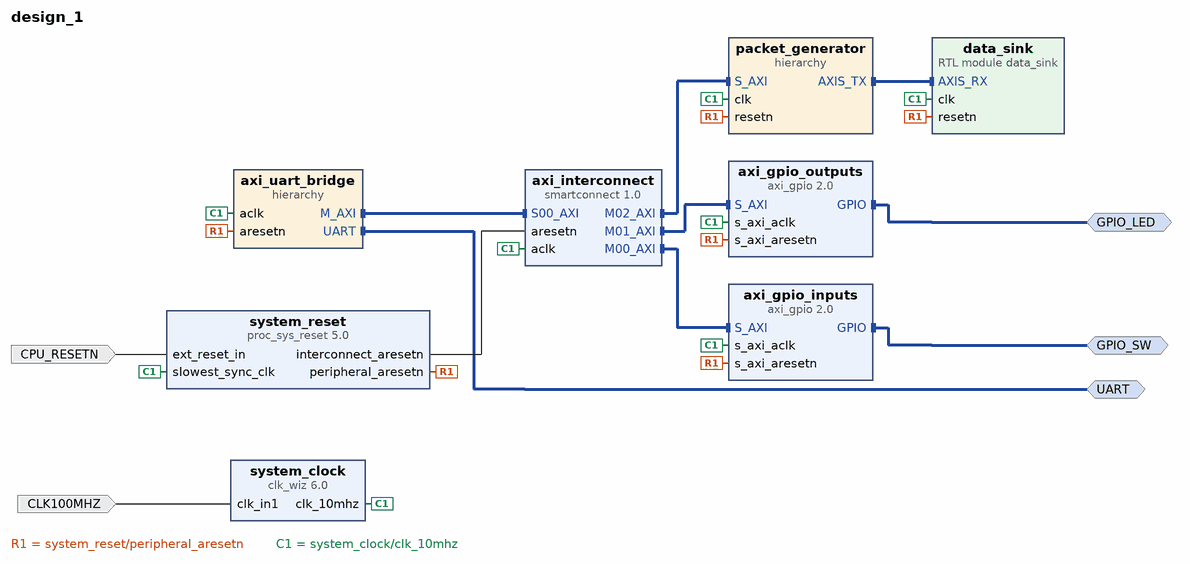
[diagram p0: block diagram of the top level]
# Vivado block design design_1, xc7a100tcsg324-1, Vivado 2021.1
create_bd_design design_1

create_bd_intf_port -mode Master -vlnv xilinx.com:interface:gpio_rtl:1.0 GPIO_LED
create_bd_intf_port -mode Master -vlnv xilinx.com:interface:gpio_rtl:1.0 GPIO_SW
create_bd_intf_port -mode Master -vlnv xilinx.com:interface:uart_rtl:1.0 UART
create_bd_port -dir I -type clk CLK100MHZ
set_property -dict {CONFIG.ASSOCIATED_RESET CPU_RESETN} [get_bd_ports CLK100MHZ]
create_bd_port -dir I -type rst CPU_RESETN

create_bd_cell -type ip -vlnv xilinx.com:ip:clk_wiz:6.0 system_clock
set_property -dict [list \
  CONFIG.CLKOUT1_DRIVES BUFGCE \
  CONFIG.CLKOUT1_JITTER 151.636 \
  CONFIG.CLKOUT1_PHASE_ERROR 98.575 \
  CONFIG.CLKOUT1_REQUESTED_OUT_FREQ 50.00 \
  CONFIG.CLKOUT2_DRIVES BUFGCE \
  CONFIG.CLKOUT3_DRIVES BUFGCE \
  CONFIG.CLKOUT4_DRIVES BUFGCE \
  CONFIG.CLKOUT5_DRIVES BUFGCE \
  CONFIG.CLKOUT6_DRIVES BUFGCE \
  CONFIG.CLKOUT7_DRIVES BUFGCE \
  CONFIG.CLK_OUT1_PORT clk_10mhz \
  CONFIG.FEEDBACK_SOURCE FDBK_AUTO \
  CONFIG.MMCM_CLKFBOUT_MULT_F 10.000 \
  CONFIG.MMCM_CLKOUT0_DIVIDE_F 20.000 \
  CONFIG.MMCM_DIVCLK_DIVIDE 1 \
  CONFIG.USE_LOCKED false \
  CONFIG.USE_RESET false \
  CONFIG.USE_SAFE_CLOCK_STARTUP true \
] [get_bd_cells system_clock]
create_bd_cell -type ip -vlnv xilinx.com:ip:proc_sys_reset:5.0 system_reset
set_property -dict {CONFIG.RESET_BOARD_INTERFACE reset CONFIG.USE_BOARD_FLOW true} [get_bd_cells system_reset]
create_bd_cell -type ip -vlnv xilinx.com:ip:smartconnect:1.0 axi_interconnect
set_property -dict {CONFIG.NUM_MI 4 CONFIG.NUM_SI 1} [get_bd_cells axi_interconnect]
create_bd_cell -type ip -vlnv xilinx.com:ip:axi_gpio:2.0 axi_gpio_inputs
set_property -dict [list \
  CONFIG.C_GPIO_WIDTH 4 \
  CONFIG.GPIO_BOARD_INTERFACE Custom \
  CONFIG.USE_BOARD_FLOW true \
] [get_bd_cells axi_gpio_inputs]
create_bd_cell -type ip -vlnv xilinx.com:ip:axi_gpio:2.0 axi_gpio_outputs
set_property -dict [list \
  CONFIG.C_ALL_INPUTS 0 \
  CONFIG.C_ALL_OUTPUTS 1 \
  CONFIG.C_GPIO_WIDTH 4 \
  CONFIG.GPIO_BOARD_INTERFACE Custom \
  CONFIG.USE_BOARD_FLOW true \
] [get_bd_cells axi_gpio_outputs]
create_bd_cell -type hier axi_uart_bridge
create_bd_cell -type module -reference data_sink data_sink
create_bd_cell -type hier packet_generator

# ---- hierarchy /axi_uart_bridge ----
current_bd_instance /axi_uart_bridge
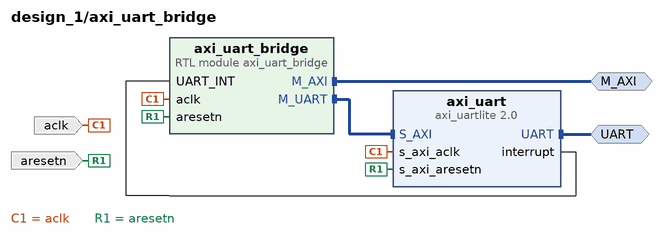
[diagram p1: block diagram inside /axi_uart_bridge]
create_bd_intf_pin -mode Master -vlnv xilinx.com:interface:aximm_rtl:1.0 M_AXI
create_bd_intf_pin -mode Master -vlnv xilinx.com:interface:uart_rtl:1.0 UART
create_bd_pin -dir I -type clk aclk
create_bd_pin -dir I -type rst aresetn

create_bd_cell -type module -reference axi_uart_bridge axi_uart_bridge
set_property -dict {CONFIG.CLOCK_FREQ 50000000} [get_bd_cells axi_uart_bridge]
create_bd_cell -type ip -vlnv xilinx.com:ip:axi_uartlite:2.0 axi_uart
set_property -dict [list \
  CONFIG.C_BAUDRATE 115200 \
  CONFIG.UARTLITE_BOARD_INTERFACE Custom \
  CONFIG.USE_BOARD_FLOW true \
] [get_bd_cells axi_uart]

# ---- hierarchy /packet_generator ----
current_bd_instance /packet_generator
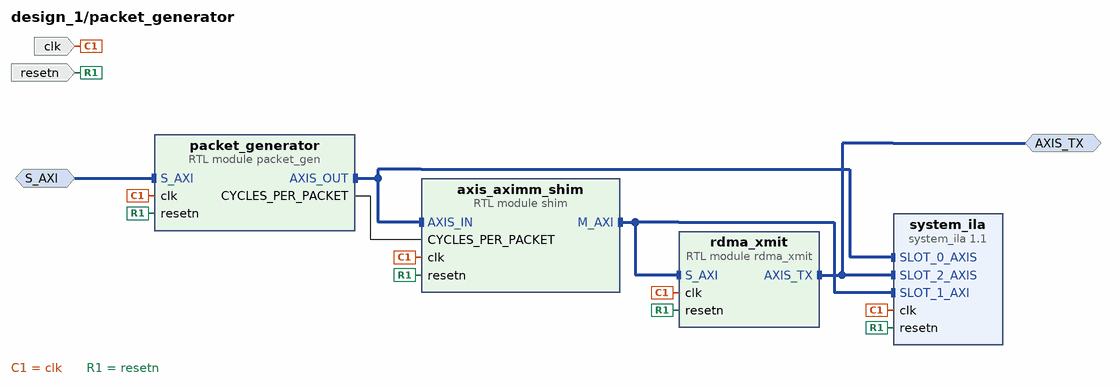
[diagram p2: block diagram inside /packet_generator]
create_bd_intf_pin -mode Slave -vlnv xilinx.com:interface:aximm_rtl:1.0 S_AXI
create_bd_intf_pin -mode Master -vlnv xilinx.com:interface:axis_rtl:1.0 AXIS_TX
create_bd_pin -dir I -type clk clk
create_bd_pin -dir I -type rst resetn

create_bd_cell -type module -reference shim axis_aximm_shim
create_bd_cell -type module -reference rdma_xmit rdma_xmit
create_bd_cell -type ip -vlnv xilinx.com:ip:system_ila:1.1 system_ila
set_property -dict [list \
  CONFIG.C_NUM_MONITOR_SLOTS 3 \
  CONFIG.C_SLOT 2 \
  CONFIG.C_SLOT_0_INTF_TYPE xilinx.com:interface:axis_rtl:1.0 \
  CONFIG.C_SLOT_1_INTF_TYPE xilinx.com:interface:aximm_rtl:1.0 \
  CONFIG.C_SLOT_2_INTF_TYPE xilinx.com:interface:axis_rtl:1.0 \
] [get_bd_cells system_ila]
create_bd_cell -type module -reference packet_gen packet_generator

# ---- connections ----

current_bd_instance /axi_uart_bridge
connect_bd_intf_net [get_bd_intf_pins UART] [get_bd_intf_pins axi_uart/UART]
connect_bd_intf_net [get_bd_intf_pins M_AXI] [get_bd_intf_pins axi_uart_bridge/M_AXI]
connect_bd_intf_net [get_bd_intf_pins axi_uart_bridge/M_UART] [get_bd_intf_pins axi_uart/S_AXI]
connect_bd_net [get_bd_pins aclk] [get_bd_pins axi_uart_bridge/aclk] [get_bd_pins axi_uart/s_axi_aclk]
connect_bd_net [get_bd_pins aresetn] [get_bd_pins axi_uart_bridge/aresetn] [get_bd_pins axi_uart/s_axi_aresetn]
connect_bd_net [get_bd_pins axi_uart/interrupt] [get_bd_pins axi_uart_bridge/UART_INT]

current_bd_instance /packet_generator
connect_bd_intf_net [get_bd_intf_pins S_AXI] [get_bd_intf_pins packet_generator/S_AXI]
connect_bd_intf_net [get_bd_intf_pins AXIS_TX] [get_bd_intf_pins rdma_xmit/AXIS_TX]
connect_bd_intf_net [get_bd_intf_pins AXIS_TX] [get_bd_intf_pins system_ila/SLOT_2_AXIS]
connect_bd_intf_net [get_bd_intf_pins axis_aximm_shim/M_AXI] [get_bd_intf_pins rdma_xmit/S_AXI]
connect_bd_intf_net [get_bd_intf_pins axis_aximm_shim/M_AXI] [get_bd_intf_pins system_ila/SLOT_1_AXI]
connect_bd_intf_net [get_bd_intf_pins packet_generator/AXIS_OUT] [get_bd_intf_pins axis_aximm_shim/AXIS_IN]
connect_bd_intf_net [get_bd_intf_pins packet_generator/AXIS_OUT] [get_bd_intf_pins system_ila/SLOT_0_AXIS]
connect_bd_net [get_bd_pins clk] \
  [get_bd_pins axis_aximm_shim/clk] [get_bd_pins rdma_xmit/clk] [get_bd_pins system_ila/clk] \
  [get_bd_pins packet_generator/clk]
connect_bd_net [get_bd_pins packet_generator/CYCLES_PER_PACKET] [get_bd_pins axis_aximm_shim/CYCLES_PER_PACKET]
connect_bd_net [get_bd_pins resetn] \
  [get_bd_pins axis_aximm_shim/resetn] [get_bd_pins rdma_xmit/resetn] [get_bd_pins system_ila/resetn] \
  [get_bd_pins packet_generator/resetn]

current_bd_instance /
connect_bd_intf_net [get_bd_intf_ports GPIO_SW] [get_bd_intf_pins axi_gpio_inputs/GPIO]
connect_bd_intf_net [get_bd_intf_ports GPIO_LED] [get_bd_intf_pins axi_gpio_outputs/GPIO]
connect_bd_intf_net [get_bd_intf_pins axi_interconnect/M00_AXI] [get_bd_intf_pins axi_gpio_inputs/S_AXI]
connect_bd_intf_net [get_bd_intf_pins axi_gpio_outputs/S_AXI] [get_bd_intf_pins axi_interconnect/M01_AXI]
connect_bd_intf_net [get_bd_intf_pins axi_interconnect/M02_AXI] [get_bd_intf_pins packet_generator/S_AXI]
connect_bd_intf_net -intf_net hier_0_AXIS_TX [get_bd_intf_pins data_sink/AXIS_RX] [get_bd_intf_pins packet_generator/AXIS_TX]
connect_bd_intf_net -intf_net hier_0_M_AXI [get_bd_intf_pins axi_interconnect/S00_AXI] [get_bd_intf_pins axi_uart_bridge/M_AXI]
connect_bd_intf_net -intf_net hier_0_UART [get_bd_intf_ports UART] [get_bd_intf_pins axi_uart_bridge/UART]
connect_bd_net -net clk_in1_0_1 [get_bd_ports CLK100MHZ] [get_bd_pins system_clock/clk_in1]
connect_bd_net -net ext_reset_in_0_1 [get_bd_ports CPU_RESETN] [get_bd_pins system_reset/ext_reset_in]
connect_bd_net -net proc_sys_reset_0_peripheral_aresetn [get_bd_pins system_reset/peripheral_aresetn] \
  [get_bd_pins axi_gpio_inputs/s_axi_aresetn] [get_bd_pins axi_gpio_outputs/s_axi_aresetn] \
  [get_bd_pins axi_uart_bridge/aresetn] [get_bd_pins data_sink/resetn] [get_bd_pins packet_generator/resetn]
connect_bd_net -net system_clock_clk_100mhz [get_bd_pins system_clock/clk_10mhz] \
  [get_bd_pins system_reset/slowest_sync_clk] [get_bd_pins axi_interconnect/aclk] [get_bd_pins axi_gpio_inputs/s_axi_aclk] \
  [get_bd_pins axi_gpio_outputs/s_axi_aclk] [get_bd_pins axi_uart_bridge/aclk] [get_bd_pins data_sink/clk] \
  [get_bd_pins packet_generator/clk]
connect_bd_net [get_bd_pins system_reset/interconnect_aresetn] [get_bd_pins axi_interconnect/aresetn]

# ---- address map ----
assign_bd_address -offset 0x0000000000001000 -range 256 -target_address_space [get_bd_addr_spaces axi_uart_bridge/axi_uart_bridge/M_AXI] [get_bd_addr_segs packet_generator/packet_generator/S_AXI/reg0]
assign_bd_address -offset 0x0000000040000000 -range 64K -target_address_space [get_bd_addr_spaces axi_uart_bridge/axi_uart_bridge/M_AXI] [get_bd_addr_segs axi_gpio_inputs/S_AXI/Reg]
assign_bd_address -offset 0x0000000040010000 -range 64K -target_address_space [get_bd_addr_spaces axi_uart_bridge/axi_uart_bridge/M_AXI] [get_bd_addr_segs axi_gpio_outputs/S_AXI/Reg]
assign_bd_address -offset 0x40600000 -range 64K -target_address_space [get_bd_addr_spaces axi_uart_bridge/axi_uart_bridge/M_UART] [get_bd_addr_segs axi_uart_bridge/axi_uart/S_AXI/Reg]
assign_bd_address -offset 0x0000000000000000 -range 16E -target_address_space [get_bd_addr_spaces packet_generator/axis_aximm_shim/M_AXI] [get_bd_addr_segs packet_generator/rdma_xmit/S_AXI/reg0]

validate_bd_design
save_bd_design
